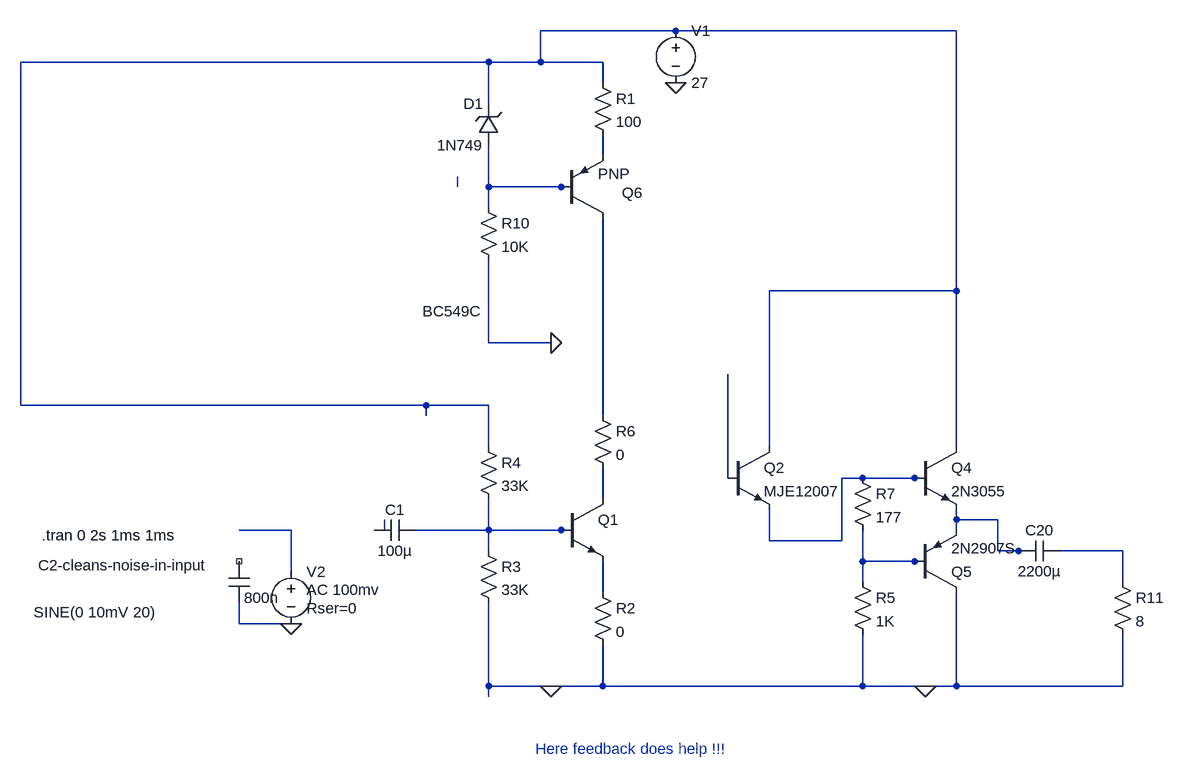
[diagram p0: schematic Current Source- Push pull with MJE3055.asc]
Current Source- Push pull with MJE3055.asc, the LTspice schematic file:
Version 4
SHEET 1 1788 680
WIRE 336 -656 128 -656
WIRE 768 -656 336 -656
WIRE 48 -608 -672 -608
WIRE 128 -608 128 -656
WIRE 128 -608 48 -608
WIRE 224 -608 128 -608
WIRE 224 -576 224 -608
WIRE 48 -544 48 -608
WIRE 224 -464 224 -496
WIRE 0 -416 0 -432
WIRE 48 -416 48 -480
WIRE 160 -416 48 -416
WIRE 176 -416 160 -416
WIRE 48 -384 48 -416
WIRE 768 -256 768 -656
WIRE 768 -256 480 -256
WIRE 48 -176 48 -304
WIRE 144 -176 48 -176
WIRE -672 -80 -672 -608
WIRE -48 -80 -672 -80
WIRE 48 -80 -48 -80
WIRE -48 -64 -48 -80
WIRE 224 -64 224 -368
WIRE 48 -16 48 -80
WIRE 480 -16 480 -256
WIRE 768 -16 768 -256
WIRE 416 32 416 -128
WIRE 624 32 592 32
WIRE 704 32 624 32
WIRE 720 32 704 32
WIRE 224 64 224 16
WIRE 768 96 768 80
WIRE 832 96 768 96
WIRE -256 112 -336 112
WIRE -112 112 -112 96
WIRE -112 112 -128 112
WIRE 48 112 48 64
WIRE 48 112 -64 112
WIRE 160 112 48 112
WIRE 176 112 160 112
WIRE 768 112 768 96
WIRE 480 128 480 80
WIRE 592 128 592 32
WIRE 592 128 480 128
WIRE 48 144 48 112
WIRE 832 144 832 96
WIRE 864 144 832 144
WIRE 880 144 864 144
WIRE 1024 144 928 144
WIRE 624 160 624 112
WIRE 704 160 624 160
WIRE 720 160 704 160
WIRE -256 176 -256 112
WIRE 624 192 624 160
WIRE 1024 192 1024 144
WIRE 224 208 224 160
WIRE -336 256 -336 224
WIRE -256 256 -336 256
WIRE 48 352 48 224
WIRE 144 352 48 352
WIRE 224 352 224 288
WIRE 224 352 144 352
WIRE 624 352 624 272
WIRE 624 352 224 352
WIRE 720 352 624 352
WIRE 768 352 768 208
WIRE 768 352 720 352
WIRE 1024 352 1024 272
WIRE 1024 352 768 352
WIRE 48 368 48 352
FLAG 336 -576 0
FLAG 144 352 0
FLAG -256 256 0
FLAG 720 352 0
FLAG 144 -176 0
SYMBOL npn 160 64 R0
WINDOW 3 -214 -289 Left 2
SYMATTR Value BC549C
SYMATTR InstName Q1
SYMBOL voltage 336 -672 R0
WINDOW 123 0 0 Left 2
WINDOW 39 0 0 Left 2
SYMATTR InstName V1
SYMATTR Value 27
SYMBOL res 32 -32 R0
SYMATTR InstName R4
SYMATTR Value 33K
SYMBOL res 32 128 R0
SYMATTR InstName R3
SYMATTR Value 33K
SYMBOL cap -64 96 R90
WINDOW 0 0 32 VBottom 2
WINDOW 3 32 32 VTop 2
SYMATTR InstName C1
SYMATTR Value 100µ
SYMBOL voltage -256 160 R0
WINDOW 123 24 44 Left 2
WINDOW 39 24 72 Left 2
WINDOW 3 -396 78 Left 2
SYMATTR Value2 AC 100mv
SYMATTR SpiceLine Rser=0
SYMATTR Value SINE(0 10mV 20)
SYMATTR InstName V2
SYMBOL npn2 704 -16 R0
SYMATTR InstName Q4
SYMATTR Value 2N3055
SYMBOL res 1008 176 R0
SYMATTR InstName R11
SYMATTR Value 8
SYMBOL pnp 704 208 M180
SYMATTR InstName Q5
SYMATTR Value 2N2907S
SYMBOL cap 928 128 R90
WINDOW 0 0 32 VBottom 2
WINDOW 3 32 32 VTop 2
SYMATTR InstName C20
SYMATTR Value 2200µ
SYMBOL res 608 176 R0
SYMATTR InstName R5
SYMATTR Value 1K
SYMBOL res 608 16 R0
SYMATTR InstName R7
SYMATTR Value 177
SYMBOL npn 416 -16 R0
SYMATTR InstName Q2
SYMATTR Value MJE12007
SYMBOL cap -352 160 R0
WINDOW 0 -293 6 Left 2
SYMATTR InstName C2-cleans-noise-in-input
SYMATTR Value 800n
SYMBOL res 32 -400 R0
SYMATTR InstName R10
SYMATTR Value 10K
SYMBOL res 208 192 R0
SYMATTR InstName R2
SYMATTR Value 0
SYMBOL res 208 -592 R0
SYMATTR InstName R1
SYMATTR Value 100
SYMBOL pnp 160 -368 M180
WINDOW 0 93 39 Left 2
SYMATTR InstName Q6
SYMBOL res 208 -80 R0
SYMATTR InstName R6
SYMATTR Value 0
SYMBOL zener 64 -480 R180
WINDOW 0 24 64 Left 2
WINDOW 3 24 0 Left 2
SYMATTR InstName D1
SYMATTR Value 1N749
TEXT -640 120 Left 2 !.tran 0 2s 1ms 1ms
TEXT 120 448 Left 2 ;Here feedback does help !!!

The netlist it stands for:
* Current Source- Push pull with MJE3055.asc
Q1 N008 N012 N015 0 BC549C
V1 N001 0 27
R4 N001 N012 33K
R3 N012 0 33K
C1 N012 N011 100µ
V2 N010 0 SINE(0 10mV 20) AC 100mv Rser=0
Q4 N001 N007 N009 0 2N3055
R11 N013 0 8
Q5 0 N014 N009 0 2N2907S
C20 N013 N009 2200µ
R5 N014 0 1K
R7 N007 N014 177
Q2 N001 N006 N007 0 MJE12007
C2-cleans-noise-in-input NC_01 0 800n
R10 N004 0 10K
R2 N015 0 0
R1 N001 N002 100
Q6 N005 N004 N002 0 PNP
R6 N005 N008 0
D1 N004 N001 1N749
.model D D
.lib standard.dio
.model NPN NPN
.model PNP PNP
.lib standard.bjt
.tran 0 2s 1ms 1ms
* Here feedback does help !!!
.backanno
.end